# Altium schematic sheet P2.schdoc
size 594 x 421 mm; Symbol: Sheet-Symbol_A4; Company: EE_LAB; Version: V1.0; Page Size: A4; @Project Name: VIDEO_CONVERTER; @Page Count: 3; @Update Date: 2024-05-22; @Create Date: 2024-05-10; @Schematic Name: Schematic1; @Page No: 2; @Page Name: P2; Device: Sheet-Symbol_A4
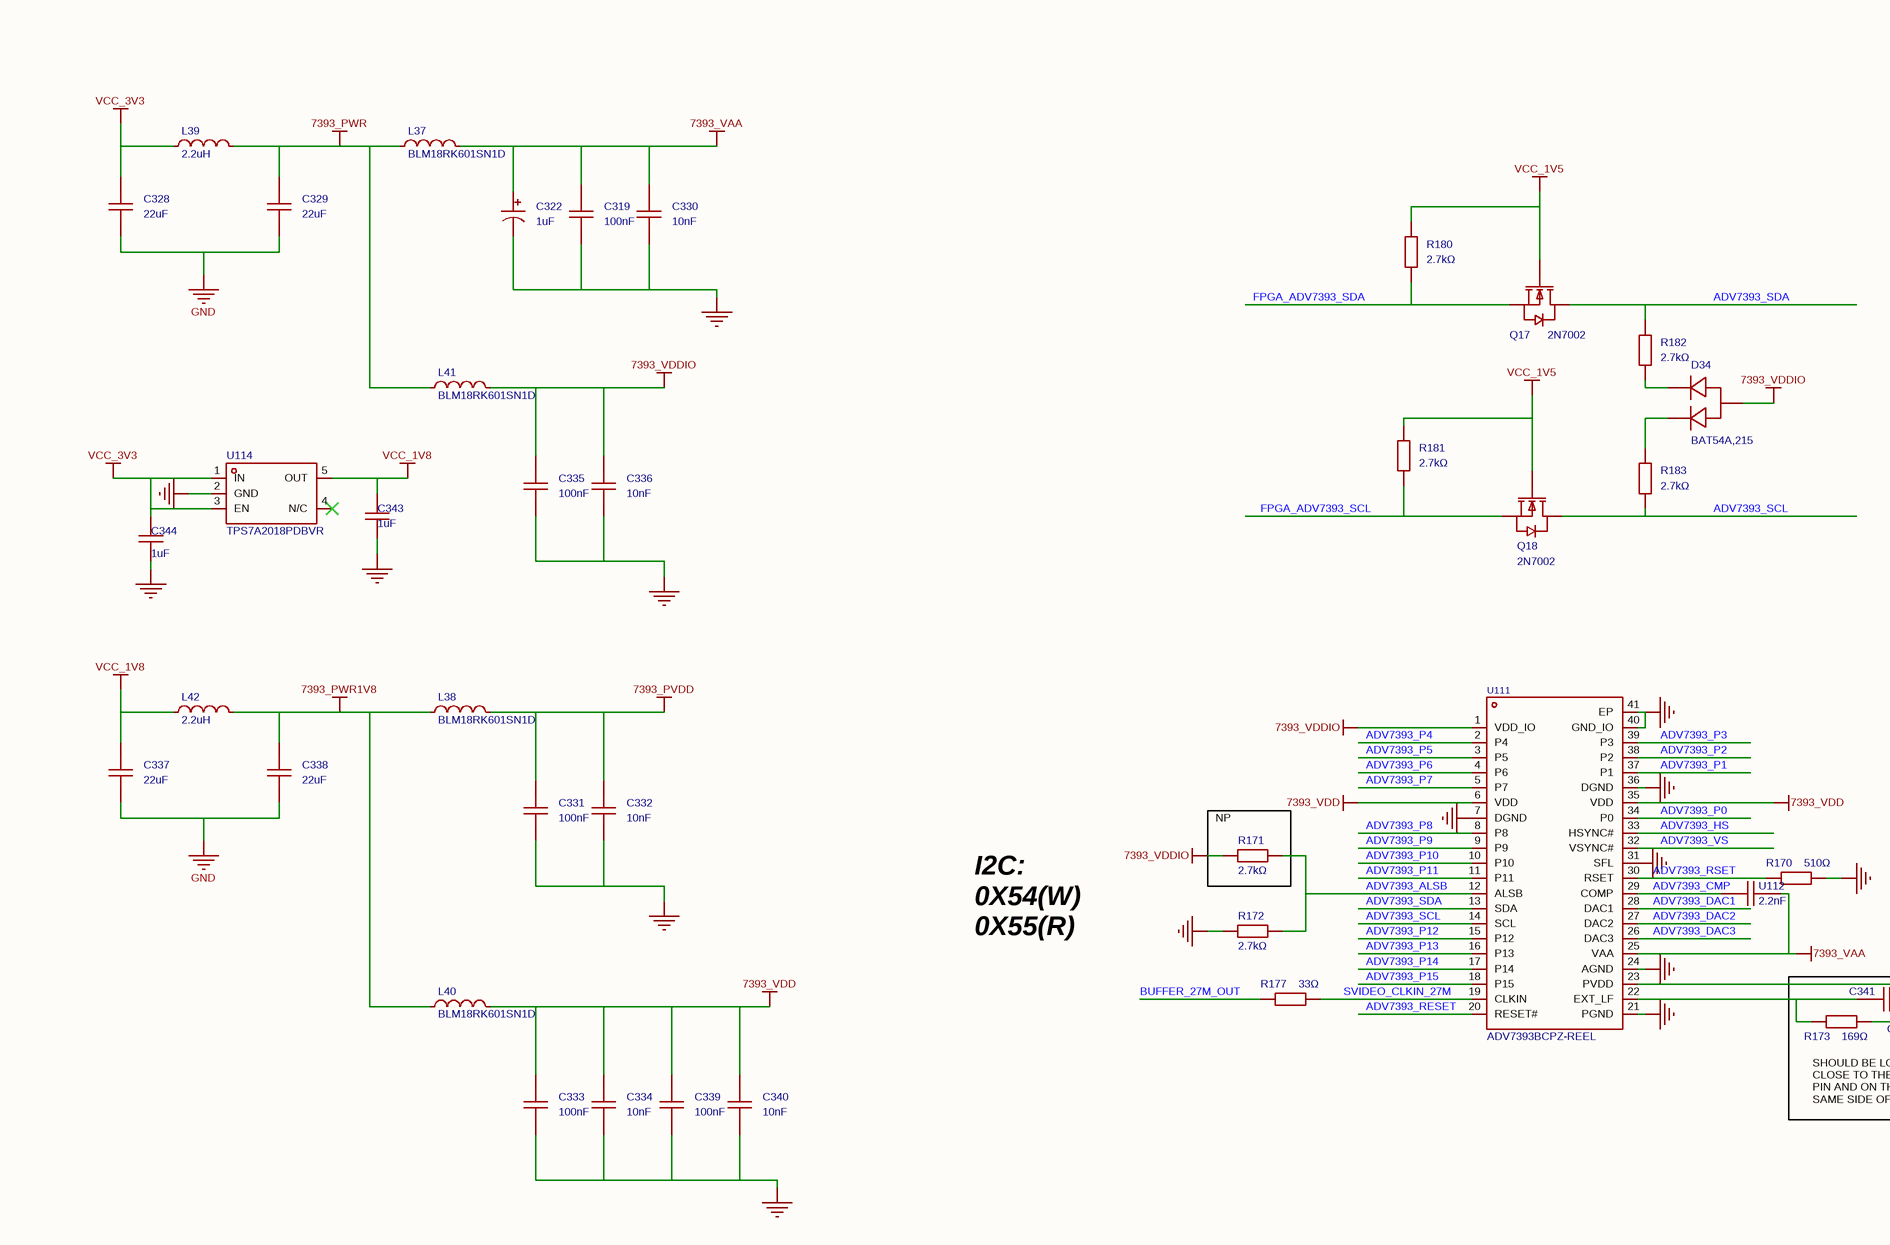
[diagram p0: P2.schdoc, top left]
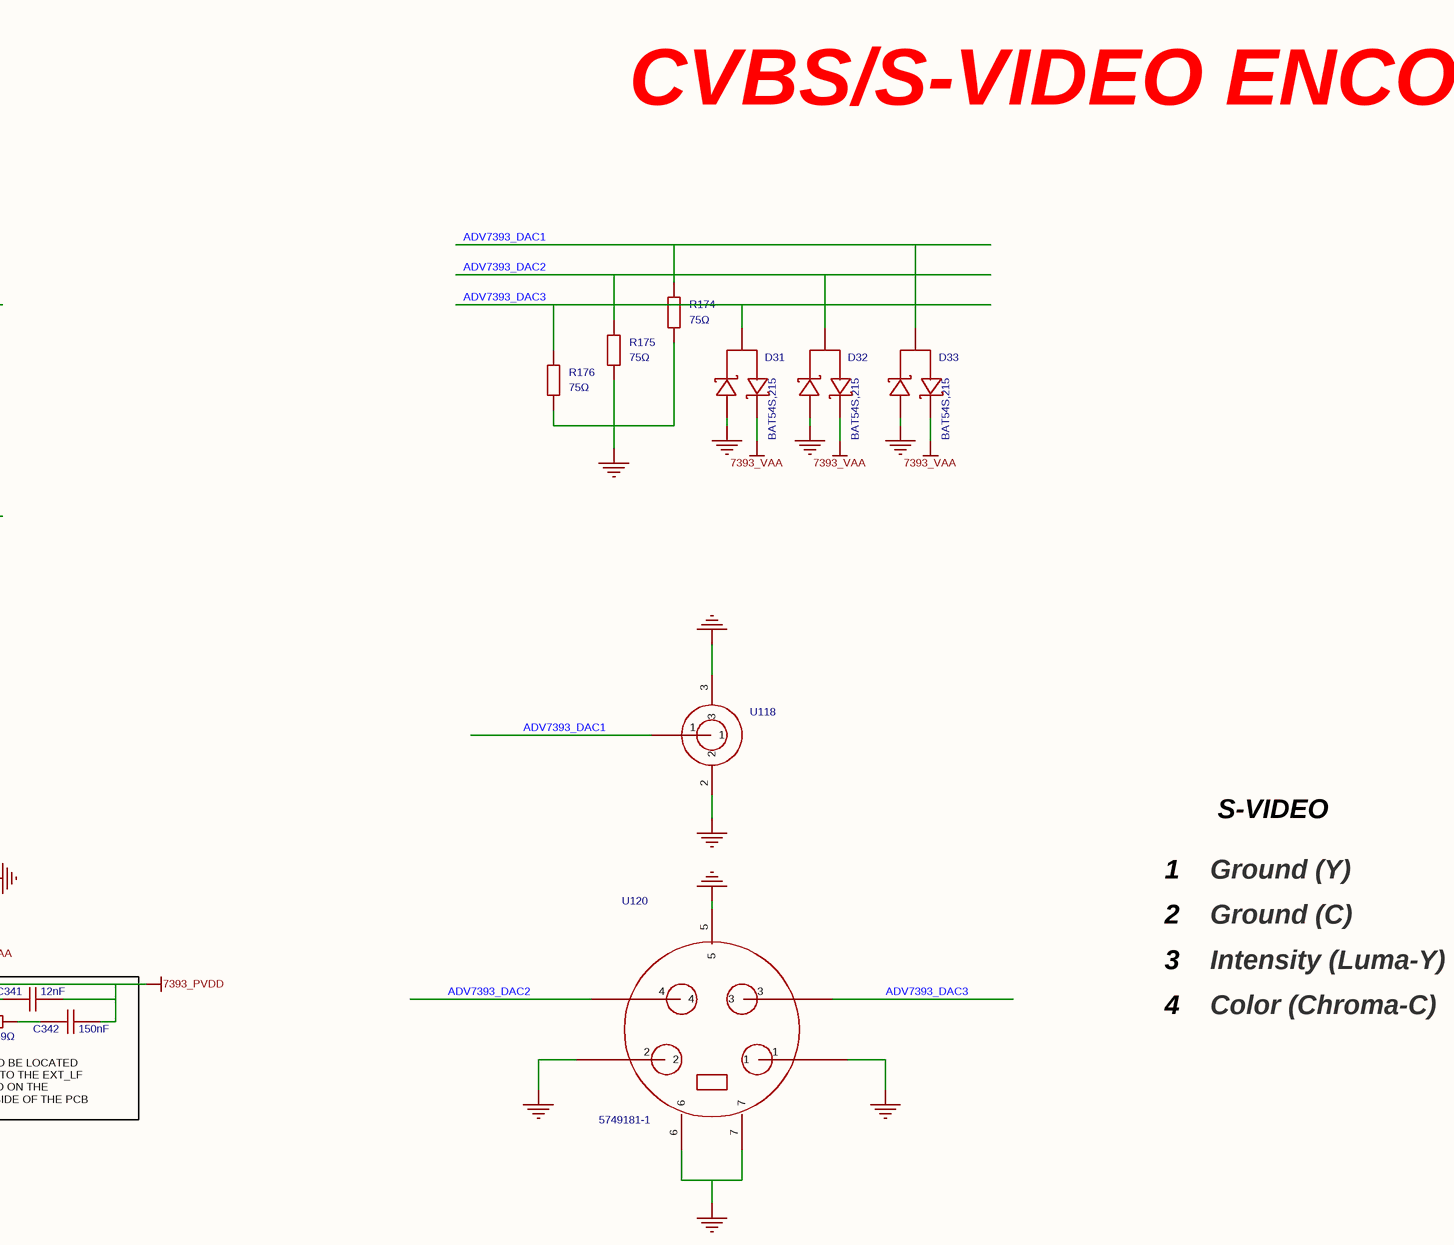
[diagram p1: P2.schdoc, top right]
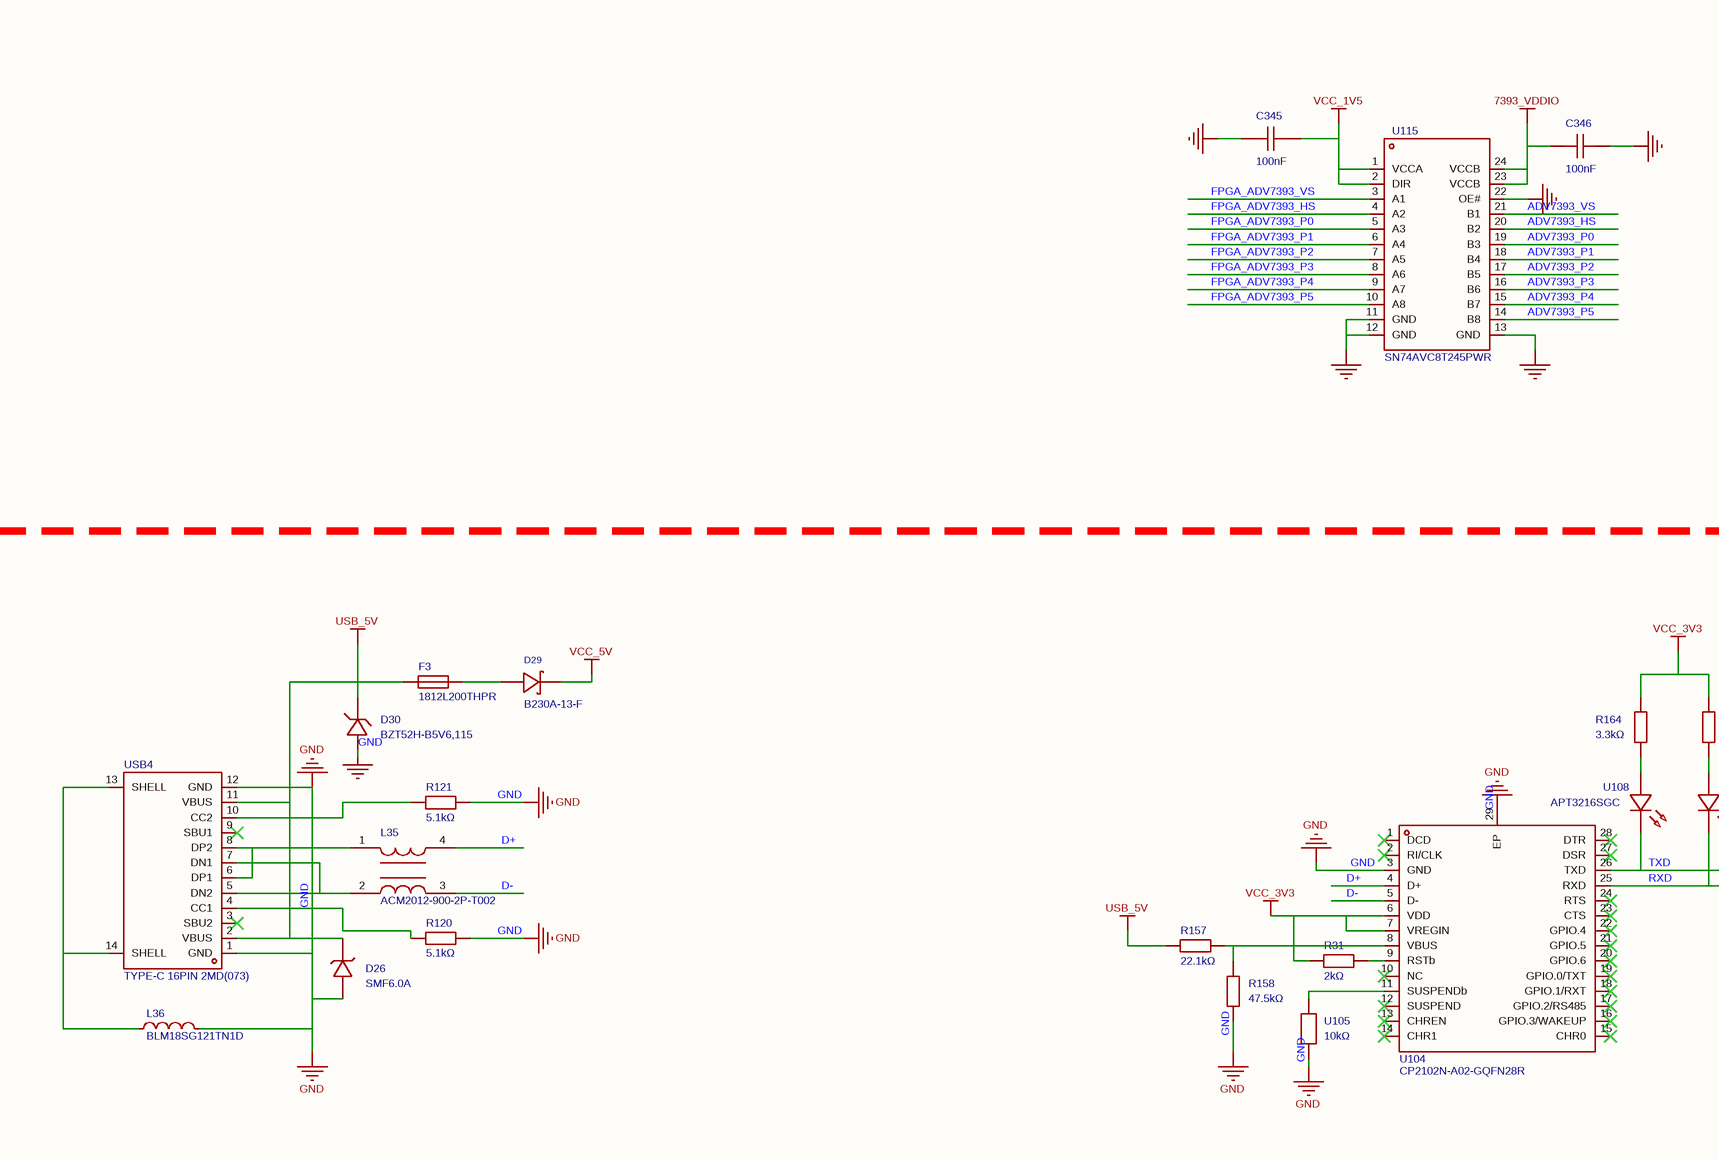
[diagram p2: P2.schdoc, bottom left]
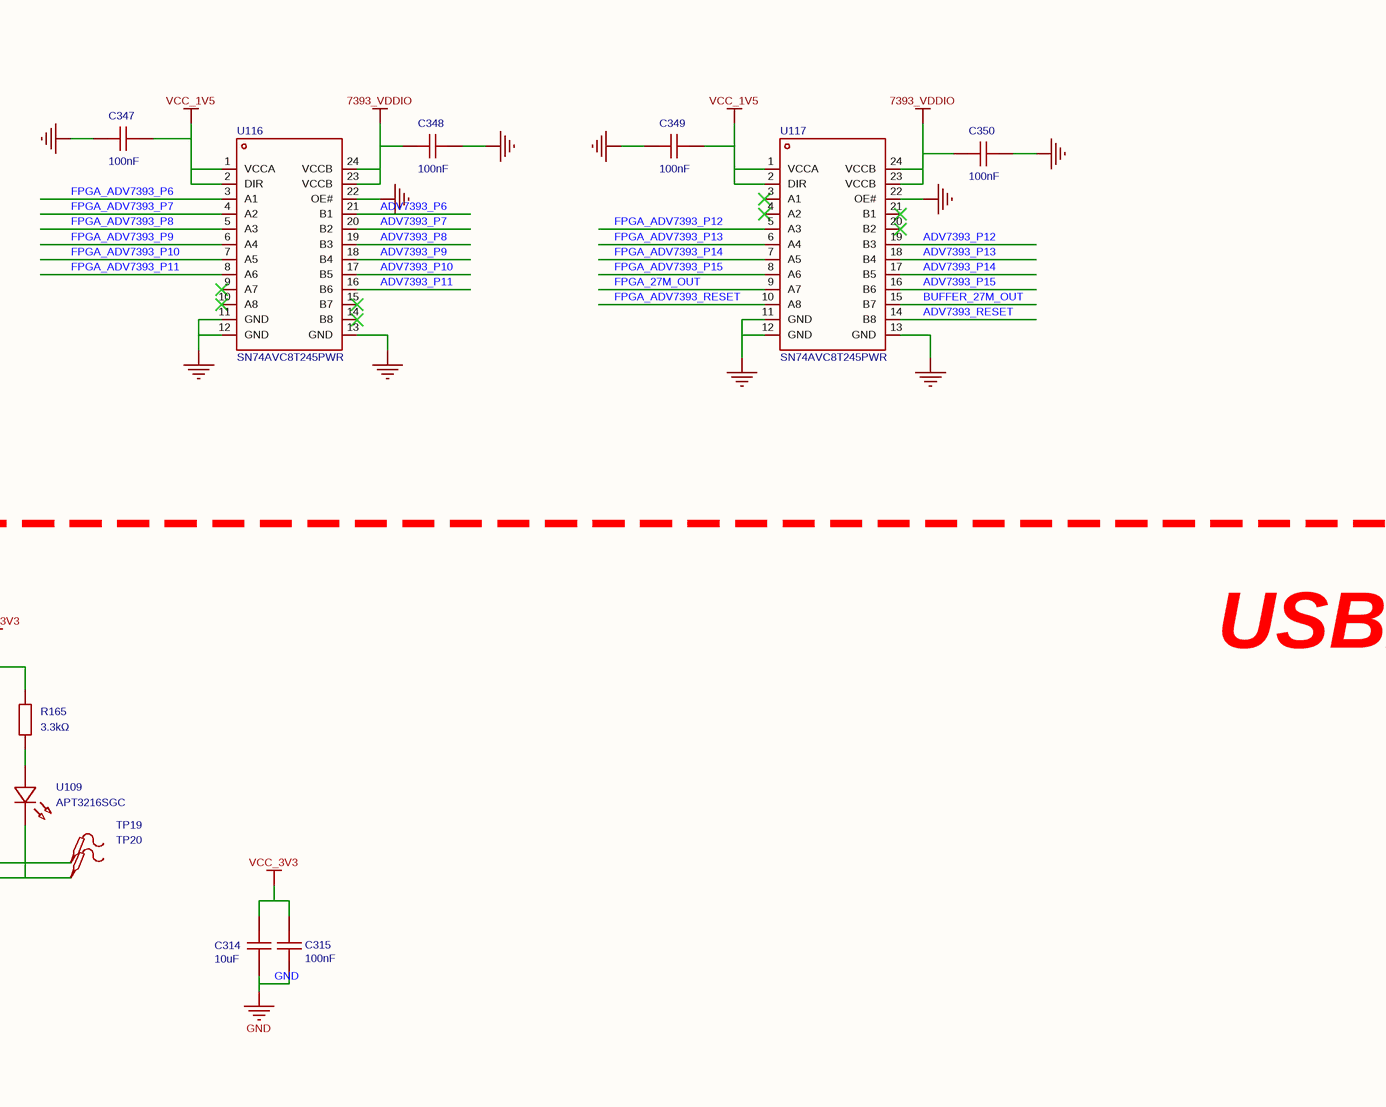
[diagram p3: P2.schdoc, bottom right]

## Parts
C314  10uF  [C0603]
C315  100nF  [C0603]
C319  100nF  [C0402]
C322  1uF  [CAP-SMD_L3.2-W1.6-FD-1]
C328  22uF  [C1210]
C329  22uF  [C1210]
C330  10nF  [C0402]
C331  100nF  [C0402]
C332  10nF  [C0402]
C333  100nF  [C0402]
C334  10nF  [C0402]
C335  100nF  [C0402]
C336  10nF  [C0402]
C337  22uF  [C1210]
C338  22uF  [C1210]
C339  100nF  [C0402]
C340  10nF  [C0402]
C341  12nF  [C0402]
C342  150nF  [C0402]
C343  1uF  [C0402]
C344  1uF  [C0402]
C345  100nF  [C0603]
C346  100nF  [C0603]
C347  100nF  [C0603]
C348  100nF  [C0603]
C349  100nF  [C0603]
C350  100nF  [C0603]
D26  SMF6.0A  [SOD-123FL_L2.8-W1.8-LS3.7-RD-1]
D29  B230A-13-F  [SMA_L4.4-W2.6-LS5.0-RD]
D30  BZT52H-B5V6,115  [SOD-123F_L2.6-W1.6-LS3.5-RD]
D31  BAT54S,215  [SOT-23-3_L3.0-W1.7-P0.95-LS2.9-BR]
D32  BAT54S,215  [SOT-23-3_L3.0-W1.7-P0.95-LS2.9-BR]
D33  BAT54S,215  [SOT-23-3_L3.0-W1.7-P0.95-LS2.9-BR]
D34  BAT54A,215  [SOT-23-3_L3.0-W1.7-P0.95-LS2.9-BR]
F3  1812L200THPR  [F1812]
L35  ACM2012-900-2P-T002  [IND-SMD_4P-L2.0-W1.2-TL]
L36  BLM18SG121TN1D  [L0603]
L37  BLM18RK601SN1D  [L0603]
L38  BLM18RK601SN1D  [L0603]
L39  2.2uH  [IND-SMD_L7.0-W6.6]
L40  BLM18RK601SN1D  [L0603]
L41  BLM18RK601SN1D  [L0603]
L42  2.2uH  [IND-SMD_L7.0-W6.6]
Q17  2N7002  [SOT-23-3_L2.9-W1.3-P1.90-LS2.4-BR]
Q18  2N7002  [SOT-23-3_L2.9-W1.3-P1.90-LS2.4-BR]
R31  2kΩ  [R0402]
R120  5.1kΩ  [R0402]
R121  5.1kΩ  [R0402]
R157  22.1kΩ  [R0402]
R158  47.5kΩ  [R0402]
R164  3.3kΩ  [R0805]
R165  3.3kΩ  [R0805]
R170  510Ω  [R0402]
R171  2.7kΩ  [R0402]
R172  2.7kΩ  [R0402]
R173  169Ω  [R0402]
R174  75Ω  [R0805]
R175  75Ω  [R0805]
R176  75Ω  [R0805]
R177  33Ω  [R0402]
R180  2.7kΩ  [R0402]
R181  2.7kΩ  [R0402]
R182  2.7kΩ  [R0402]
R183  2.7kΩ  [R0402]
TP19  (no value)  [Test-Point-0.5mm]
TP20  (no value)  [Test-Point-0.5mm]
U104  CP2102N-A02-GQFN28R  [QFN-28_L5.0-W5.0-P0.50-TL-EP3.3]
U105  10kΩ  [R0402]
U108  APT3216SGC  [LED1206-RD]
U109  APT3216SGC  [LED1206-RD]
U111  ADV7393BCPZ-REEL  [LFCSP-40_L6.0-W6.0-P0.50-BL-EP4.1]
U112  2.2nF  [C0402]
U114  TPS7A2018PDBVR  [SOT-23-5_L2.9-W1.6-P0.95-LS2.8-BR]
U115  SN74AVC8T245PWR  [TSSOP-24_L7.8-W4.4-P0.65-LS6.4-BL]
U116  SN74AVC8T245PWR  [TSSOP-24_L7.8-W4.4-P0.65-LS6.4-BL]
U117  SN74AVC8T245PWR  [TSSOP-24_L7.8-W4.4-P0.65-LS6.4-BL]
U118  (no value)  [RCA-Y]
U120  Manufacturer Part: 5749181-1  [MINI_DIN_4]
USB4  TYPE-C 16PIN 2MD(073)  [USB-C-SMD_TYPE-C-6PIN-2MD-073]

## Blocks framed on the sheet
NP: R171

## Nets
7393_PVDD: C331.1 C332.2 C341.2 C342.2 L38.2 U111.23(PVDD)
7393_PWR: C329.2 L37.1 L39.2 L41.1
7393_PWR1V8: C338.2 L38.1 L40.1 L42.2
7393_VAA: C319.1 C322.1 C330.2 D31.2(K) D32.2(K) D33.2(K) L37.2 U111.25(VAA) U112.2
7393_VDD: C333.1 C334.2 C339.1 C340.2 L40.2 U111.6(VDD) U111.35(VDD)
7393_VDDIO: C335.1 C336.2 C346.1 C348.1 C350.1 D34.3(C) L41.2 R171.2 U111.1(VDD_IO) U115.23(VCCB) U115.24(VCCB) U116.23(VCCB) U116.24(VCCB) U117.23(VCCB) U117.24(VCCB)
GND: C314.1 C315.1 C319.2 C322.2 C328.1 C329.1 C330.1 C331.2 C332.1 C333.2 C334.1 C335.2 C336.1 C337.1 C338.1 C339.2 C340.1 C343.1 C344.1 C345.2 C346.2 C347.2 C348.2 C349.2 C350.2 D26.2 D30.2(A) D31.1(A) D32.1(A) D33.1(A) L36.2 R120.1 R120.2 R121.2 R158.1 R170.2 R172.2 R174.2 R175.1 R176.1 U104.3(GND) U104.29(EP) U105.2 U111.7(DGND) U111.21(PGND) U111.24(AGND) U111.31(SFL) U111.36(DGND) U111.40(GND_IO) U111.41(EP) U114.2(GND) U115.11(GND) U115.12(GND) U115.13(GND) U115.22(OE#) U116.11(GND) U116.12(GND) U116.13(GND) U116.22(OE#) U117.11(GND) U117.12(GND) U117.13(GND) U117.22(OE#) U118.2 U118.3 U120.1 U120.2 U120.5 U120.6 U120.7 USB4.1(GND) USB4.4(CC1) USB4.12(GND)
USB_5V: D26.1 D30.1(C) F3.2 R157.2 USB4.2(VBUS) USB4.11(VBUS)
VCC_1V5: C345.1 C347.1 C349.1 Q17.1(G) Q18.1(G) R180.2 R181.2 U115.1(VCCA) U115.2(DIR) U116.1(VCCA) U116.2(DIR) U117.1(VCCA) U117.2(DIR)
VCC_1V8: C337.2 C343.2 L42.1 U114.5(OUT)
VCC_3V3: C314.2 C315.2 C328.2 C344.2 L39.1 R31.1 R164.2 R165.2 U104.6(VDD) U104.7(VREGIN) U114.1(IN) U114.3(EN)
VCC_5V: D29.1(K)
ADV7393_ALSB: R171.1 R172.1 U111.12(ALSB)
ADV7393_CMP: U111.29(COMP) U112.1
ADV7393_DAC1: D33.3(AK) R174.1 U111.28(DAC1) U118.1
ADV7393_DAC2: D32.3(AK) R175.2 U111.27(DAC2) U120.4
ADV7393_DAC3: D31.3(AK) R176.2 U111.26(DAC3) U120.3
ADV7393_HS: U111.33(HSYNC#) U115.20(B2)
ADV7393_P0: U111.34(P0) U115.19(B3)
ADV7393_P1: U111.37(P1) U115.18(B4)
ADV7393_P2: U111.38(P2) U115.17(B5)
ADV7393_P3: U111.39(P3) U115.16(B6)
ADV7393_P4: U111.2(P4) U115.15(B7)
ADV7393_P5: U111.3(P5) U115.14(B8)
ADV7393_P6: U111.4(P6) U116.21(B1)
ADV7393_P7: U111.5(P7) U116.20(B2)
ADV7393_P8: U111.8(P8) U116.19(B3)
ADV7393_P9: U111.9(P9) U116.18(B4)
ADV7393_P10: U111.10(P10) U116.17(B5)
ADV7393_P11: U111.11(P11) U116.16(B6)
ADV7393_P12: U111.15(P12) U117.19(B3)
ADV7393_P13: U111.16(P13) U117.18(B4)
ADV7393_P14: U111.17(P14) U117.17(B5)
ADV7393_P15: U111.18(P15) U117.16(B6)
ADV7393_RESET: U111.20(RESET#) U117.14(B8)
ADV7393_RSET: R170.1 U111.30(RSET)
ADV7393_SCL: Q18.3(D) R183.1 U111.14(SCL)
ADV7393_SDA: Q17.3(D) R182.2 U111.13(SDA)
ADV7393_VS: U111.32(VSYNC#) U115.21(B1)
BUFFER_27M_OUT: R177.1 U117.15(B7)
D+: L35.4 U104.4(D+)
D-: L35.3 U104.5(D-)
FPGA_27M_OUT: U117.9(A7)
FPGA_ADV7393_HS: U115.4(A2)
FPGA_ADV7393_P0: U115.5(A3)
FPGA_ADV7393_P1: U115.6(A4)
FPGA_ADV7393_P2: U115.7(A5)
FPGA_ADV7393_P3: U115.8(A6)
FPGA_ADV7393_P4: U115.9(A7)
FPGA_ADV7393_P5: U115.10(A8)
FPGA_ADV7393_P6: U116.3(A1)
FPGA_ADV7393_P7: U116.4(A2)
FPGA_ADV7393_P8: U116.5(A3)
FPGA_ADV7393_P9: U116.6(A4)
FPGA_ADV7393_P10: U116.7(A5)
FPGA_ADV7393_P11: U116.8(A6)
FPGA_ADV7393_P12: U117.5(A3)
FPGA_ADV7393_P13: U117.6(A4)
FPGA_ADV7393_P14: U117.7(A5)
FPGA_ADV7393_P15: U117.8(A6)
FPGA_ADV7393_RESET: U117.10(A8)
FPGA_ADV7393_SCL: Q18.2(S) R181.1
FPGA_ADV7393_SDA: Q17.2(S) R180.1
FPGA_ADV7393_VS: U115.3(A1)
RXD: TP20.1 U104.25(RXD) U109.1(K)
SVIDEO_CLKIN_27M: R177.2 U111.19(CLKIN)
TXD: TP19.1 U104.26(TXD) U108.1(K)
NetC341_1: C341.1 R173.1 U111.22(EXT_LF)
NetC342_1: C342.1 R173.2
NetD29_2: D29.2(A) F3.1
NetD34_1: D34.1(A) R182.1
NetD34_2: D34.2(A) R183.2
NetL35_1: L35.1 USB4.6(DP1) USB4.8(DP2)
NetL35_2: L35.2 USB4.5(DN2) USB4.7(DN1)
NetL36_1: L36.1 USB4.13(SHELL) USB4.14(SHELL)
NetR31_2: R31.2 U104.9(RSTb)
NetR121_1: R121.1 USB4.10(CC2)
NetR157_1: R157.1 R158.2 U104.8(VBUS)
NetR164_1: R164.1 U108.2(A)
NetR165_1: R165.1 U109.2(A)
NetU104_11: U104.11(SUSPENDb) U105.1

Not connected (* = marked no-connect by the designer): U104 1(DCD)* 2(RI/CLK)* 10(NC)* 12(SUSPEND)* 13(CHREN)* 14(CHR1)* 15(CHR0)* 16(GPIO.3/WAKEUP)* 17(GPIO.2/RS485)* 18(GPIO.1/RXT)* 19(GPIO.0/TXT)* 20(GPIO.6)* 21(GPIO.5)* 22(GPIO.4)* 23(CTS)* 24(RTS)* 27(DSR)* 28(DTR)*; U114 4(N/C)*; U116 9(A7)* 10(A8)* 14(B8)* 15(B7)*; U117 3(A1)* 4(A2)* 20(B2)* 21(B1)*; USB4 3(SBU2)* 9(SBU1)*

## Notes on the sheet
- CVBS/S-VIDEO ENCODER
- I2C:
  0X54(W)
  0X55(R)
- S-VIDEO
- 1
- 2
- Ground (Y)
- Ground (C)
- 3
- Intensity (Luma-Y)
- SHOULD BE LOCATED
  CLOSE TO THE EXT_LF
  PIN AND ON THE
  SAME SIDE OF THE PCB
- 4
- Color (Chroma-C)
- USB2UART
- 更新日期
- 2024-05-22
- 原理图
- 图页
- Schematic1
- P2
- 创建日期
- 物料编码
- 2024-05-10
- 审阅
- 绘制
- VIDEO_CONVERTER
- 版本
- V1.0
- 尺寸
- A4
- 页
- EE_LAB
- 共

## Library data of the parts
C314 = 10uF: Manufacturer: TDK; Manufacturer Part: C1608X5R1A106M080AC; Convert to PCB: yes; Device: 10uF; Symbol: 10uF; Supplier: LCSC; Supplier Part: C3877917; link: https://so.szlcsc.com/global.html?k=C3877917&amp;ref=editor; Add into BOM: yes; FootprintName: C0603
C315 C345-C350 = GRM188R71H104KA93D: 容值:100nF;精度:±10%;额定电压:50V;材质(温度系数):X7R;; Manufacturer: muRata(村田); Symbol: 0.1uF; Convert to PCB: yes; ModelId: ac125912035d415993ca9572d50418b1; ModelName: C0603_L1.6-W0.8-H0.8; ModelTransform: 62.992,31.496,0,0,0,0,0,0,0; Tolerance: ±10%; Voltage Rated: 50V; Temperature Coefficient: X7R; Device: GRM188R71H104KA93D; Supplier: LCSC; Supplier Part: C77055; Manufacturer Part: GRM188R71H104KA93D; JLCPCB Part Class: Extended Part; link: https://so.szlcsc.com/global.html?k=C2168571&amp;ref=editor; Add into BOM: yes; LCSC Part Name: 100nF ±10% 50V; Supplier Footprint: 0603; Datasheet: https://atta.szlcsc.com/upload/public/pdf/source/20200305/C490387_23319AE8C154DEB24C505E6C82A8106A.pdf; FootprintName: C0603; Value: 100nF
C319 C331 C333 C335 C339 = GCM155R71A104KA55D: 容值:100nF;精度:±10%;额定电压:10V;材质(温度系数):X7R;; Manufacturer: muRata(村田); AddInBom: yes; ModelId: 36a51122f27c49738f86b3bfa98863e0; ModelName: C0402_L1.0-W0.5-H0.5; ModelTransform: 39.37,19.685,0,0,0,0,0,0,0; Tolerance: ±10%; Voltage Rated: 10V; Temperature Coefficient: X7R; Symbol: GCM155R71A104KA55D; Device: GCM155R71A104KA55D; LCSC Part Name: 100nF ±10% 10V; SupplierPart: C161163; ManufacturerPart: GCM155R71A104KA55D; Supplier Footprint: 0402; JLCPCB Part Class: 扩展库; Datasheet: https://atta.szlcsc.com/upload/public/pdf/source/20180821/C161163_5F90D1CDF6FD55851A9BB75B6044C401.pdf; Supplier: LCSC; ConvertToPcb: yes; FootprintName: C0402; Value: 100nF
C322 = 293D105X9035A2TE3: 容值:1uF;精度:±10%;额定电压:35V;等效串联电阻:7.5Ω;; Manufacturer: VISHAY(威世); Symbol: 20TQC22MYFB; AddInBom: yes; ModelId: 93c1e47824ed479aadd5af965695f2d8; ModelTransform: 125.984,62.992,0,0,0,0,0,0,0; Tolerance: ±10%; Rated Voltage: 35V; Equivalent Series Resistance(ESR): 7.5Ω; Device: 293D105X9035A2TE3; Supplier: LCSC; Supplier Part: C1953185; Manufacturer Part: 293D105X9035A2TE3; Value: 1uF; JLCPCB Part Class: Extended Part; LCSC Part Name: 1uF ±10% 35V; Supplier Footprint: 1206; Datasheet: https://atta.szlcsc.com/upload/public/pdf/source/20210430/5F5654738936DAF6EE15800967345E6B.pdf; ConvertToPcb: yes; FootprintName: CAP-SMD_L3.2-W1.6-FD-1; ModelName: CAP-SMD_L3.2-W1.6-FD-1; Leakage Current(DCL): -; Ripple Current: -; Operating Temperature: -55℃~+125℃
C328 C329 C337 C338 = GRM32ER71E226KE15L: 容值:22uF;精度:±10%;额定电压:25V;材质(温度系数):X7R;; Manufacturer: muRata(村田); AddInBom: yes; ModelId: 113f675d30df4856af7632edb7ada0df; ModelName: C1210_L3.2-W2.5-H0.9; ModelTransform: 125.984,99.2124,0,0,0,0,0,0,0; Tolerance: ±10%; Voltage Rated: 25V; Temperature Coefficient: X7R; Symbol: GRM32ER71E226KE15L; Device: GRM32ER71E226KE15L; Supplier: LCSC; Supplier Part: C21397; Manufacturer Part: GRM32ER71E226KE15L; Value: 22uF; JLCPCB Part Class: 扩展库; LCSC Part Name: 22uF ±10% 25V; Supplier Footprint: 1210; Datasheet: https://atta.szlcsc.com/upload/public/pdf/source/20230811/6AA9DB9766E5496748A2F980D0C94A94.pdf; ConvertToPcb: yes; FootprintName: C1210
C330 C332 C334 C336 C340 = GRM155R71H103KA88D: 容值:10nF;精度:±10%;额定电压:50V;材质(温度系数):X7R;; Manufacturer: muRata(村田); Symbol: GCM155R71H103KA55D; AddInBom: yes; ModelId: 36a51122f27c49738f86b3bfa98863e0; ModelName: C0402_L1.0-W0.5-H0.5; ModelTransform: 39.37,19.685,0,0,0,0,0,0,0; Tolerance: ±10%; Voltage Rated: 50V; Temperature Coefficient: X7R; Device: GRM155R71H103KA88D; Supplier: LCSC; Manufacturer Part: GRM155R71H103KA88D; Value: 10nF; Supplier Part: C77019; JLCPCB Part Class: Extended Part; LCSC Part Name: 10nF ±10% 50V; Supplier Footprint: 0402; Datasheet: https://atta.szlcsc.com/upload/public/pdf/source/20180326/C77019_6A3693CE1BCE757D6A8B7C99DAE1B441.pdf; ConvertToPcb: yes; FootprintName: C0402
C341 = CC0402KRX7R8BB123: 容值:12nF;精度:±10%;额定电压:25V;材质(温度系数):X7R;; Manufacturer: YAGEO(国巨); AddInBom: yes; ModelId: 36a51122f27c49738f86b3bfa98863e0; ModelName: C0402_L1.0-W0.5-H0.5; ModelTransform: 39.37,19.685,0,0,0,0,0,0,0; Tolerance: ±10%; Voltage Rated: 25V; Temperature Coefficient: X7R; Symbol: CC0402KRX7R8BB123; Device: CC0402KRX7R8BB123; Supplier: LCSC; Supplier Part: C113786; Manufacturer Part: CC0402KRX7R8BB123; Value: 12nF; JLCPCB Part Class: 扩展库; LCSC Part Name: 12nF ±10% 25V; Supplier Footprint: 0402; Datasheet: https://atta.szlcsc.com/upload/public/pdf/source/20170914/C128857_1505359892143968080.pdf; ConvertToPcb: yes; FootprintName: C0402
C342 = GRM155R71C154KA12D: 容值:150nF;精度:±10%;额定电压:16V;材质(温度系数):X7R;; Manufacturer: muRata(村田); AddInBom: yes; ModelId: 36a51122f27c49738f86b3bfa98863e0; ModelName: C0402_L1.0-W0.5-H0.5; ModelTransform: 39.37,19.685,0,0,0,0,0,0,0; Tolerance: ±10%; Voltage Rated: 16V; Temperature Coefficient: X7R; Symbol: GRM155R71C154KA12D; Device: GRM155R71C154KA12D; Supplier: LCSC; Supplier Part: C162182; Manufacturer Part: GRM155R71C154KA12D; Value: 150nF; JLCPCB Part Class: 扩展库; LCSC Part Name: 150nF ±10% 16V; Supplier Footprint: 0402; Datasheet: https://atta.szlcsc.com/upload/public/pdf/source/20200305/C490387_23319AE8C154DEB24C505E6C82A8106A.pdf; ConvertToPcb: yes; FootprintName: C0402
C343 C344 = GRM155R61E105KA12D: 容值:1uF;精度:±10%;额定电压:25V;材质(温度系数):X5R;; Manufacturer: muRata(村田); AddInBom: yes; ModelId: 36a51122f27c49738f86b3bfa98863e0; ModelName: C0402_L1.0-W0.5-H0.5; ModelTransform: 39.37,19.685,0,0,0,0,0,0,0; Tolerance: ±10%; Voltage Rated: 25V; Temperature Coefficient: X5R; Symbol: GRM155R61E105KA12D; Device: GRM155R61E105KA12D; Supplier: LCSC; Manufacturer Part: GRM155R61E105KA12D; Value: 1uF; Supplier Part: C77009; JLCPCB Part Class: 扩展库; LCSC Part Name: 1uF ±10% 25V; Supplier Footprint: 0402; Datasheet: https://atta.szlcsc.com/upload/public/pdf/source/20180326/C77009_C84F63FC30571BAC77C5C818267378FE.pdf; ConvertToPcb: yes; FootprintName: C0402
D26 = SMF6.0A_C708002: 极性:单向;反向截止电压(Vrwm):6V;最大钳位电压:10.3V;峰值脉冲电流(Ipp)@10/1000us:19.4A;击穿电压:6.7V;; Manufacturer: FTR(乔光电子); AddInBom: yes; ModelId: 321bc188a2eb4b418ce08d06d1c3a1f1; ModelTransform: 145.669,70.866,0,0,0,0,0,0,0; polarity: 单向; Reverse Stand-Off Voltage (Vrwm): 6V; Maximum Clamping Voltage: 10.3V; Peak Pulse Current (Ipp)@10/1000us: 19.4A; Breakdown Voltage: 6.7V; Symbol: SMF6.0A_C708002; Device: SMF6.0A_C708002; Supplier: LCSC; Supplier Part: C708002; Manufacturer Part: SMF6.0A; JLCPCB Part Class: 扩展库; LCSC Part Name: SMF6.0A; Supplier Footprint: SMF(SOD-123FL); Datasheet: https://atta.szlcsc.com/upload/public/pdf/source/20200720/C707467_F9F5DD7822E01E4AA7143D88A897A414.pdf; ConvertToPcb: yes; FootprintName: SOD-123FL_L2.8-W1.8-LS3.7-RD-1; ModelName: SOD-123FL_L2.8-W1.8-LS3.7-RD-1
D29 = B230A-13-F: 正向压降(Vf):500mV@2A;直流反向耐压(Vr):30V;平均整流电流(Io):2A;; Manufacturer: DIODES(美台); AddInBom: yes; ModelId: a2d22152f8d5421c8e96dbd56af7c345; ModelTransform: 204.724,98.425,0,0,0,0,0,0,0; Reverse Voltage (Vr): 30V; Average Rectified Current (Io): 2A; Reverse Leakage Current (Ir): 500uA@30V; Symbol: B230A-13-F; Device: B230A-13-F; Supplier: LCSC; Manufacturer Part: B230A-13-F; Supplier Part: C12889; JLCPCB Part Class: 扩展库; LCSC Part Name: 电压:30V 电流:2A; Supplier Footprint: SMA(DO-214AC); Datasheet: https://atta.szlcsc.com/upload/public/pdf/source/20191129/C460673_65E0A67BF9F553882F22D2B39F8BCAEF.pdf; ConvertToPcb: yes; FootprintName: SMA_L4.4-W2.6-LS5.0-RD; ModelName: SMA_L4.4-W2.6-LS5.0-RD; Forward Voltage (Vf@If): 500mV@2A
D30 = BZT52H-B5V6,115: 二极管配置:独立式;稳压值(标称值):5.6V;稳压值(范围):5.49V~5.71V;功率:375mW;精度:±2%;; Manufacturer: Nexperia(安世); AddInBom: yes; ModelId: a099669e960c4e6d91214e62d8e45b94; ModelTransform: 137.795,62.992,0,0,0,0,0,0,0; Diode Configuration: 独立式; Zener Voltage (Nom): 5.6V; Reverse Leakage Current (Ir): 1uA@2V; Power Dissipation: 375mW; Zener Impedance (Zzt): 40Ω; Tolerance: ±2%; Symbol: BZT52H-B5V6,115; Device: BZT52H-B5V6,115; LCSC Part Name: BZT52H-B5V6,115; SupplierPart: C426804; ManufacturerPart: BZT52H-B5V6,115; Supplier Footprint: SOD-123F; JLCPCB Part Class: 扩展库; Datasheet: https://atta.szlcsc.com/upload/public/pdf/source/20200310/C493582_3AB991C7AA86494D92E4C7FA68C6C679.pdf; Supplier: LCSC; ConvertToPcb: yes; FootprintName: SOD-123F_L2.6-W1.6-LS3.5-RD; ModelName: SOD-123F_L2.6-W1.6-LS3.5-RD; Zener Voltage (Range): 5.49V~5.71V
D31-D33 = BAT54S,215: 二极管配置:1对串联式;正向压降(Vf):800mV@100mA;直流反向耐压(Vr):30V;平均整流电流(Io):200mA;; Manufacturer: Nexperia(安世); AddInBom: yes; ModelId: 89cb27a44ab2466697082bb9fd73a7d0; ModelName: SOT-23-3L_L2.9-W1.6-H1.1-LS2.8-P0.95; ModelTransform: 114.173,110.236,0,90,0,0,0,0,0; Diode Configuration: 1对串联式; Reverse Voltage (Vr): 30V; Average Rectified Current (Io): 200mA; Reverse Leakage Current (Ir): 2uA@25V; Symbol: BAT54S,215; Device: BAT54S,215; Supplier: LCSC; Manufacturer Part: BAT54S,215; Supplier Part: C47546; JLCPCB Part Class: 扩展库; LCSC Part Name: 电压:30V 电流:200mA; Supplier Footprint: SOT-23; Datasheet: https://atta.szlcsc.com/upload/public/pdf/source/20180326/C130910_AAC331EF45C4B7D7866DD336DA3C5D86.pdf; ConvertToPcb: yes; FootprintName: SOT-23-3_L3.0-W1.7-P0.95-LS2.9-BR; Forward Voltage (Vf@If): 800mV@100mA
D34 = BAT54A,215: 二极管配置:1对共阳极;直流反向耐压(Vr):30V;平均整流电流(Io):200mA;; Manufacturer: Nexperia(安世); AddInBom: yes; ModelId: 89cb27a44ab2466697082bb9fd73a7d0; ModelName: SOT-23-3L_L2.9-W1.6-H1.1-LS2.8-P0.95; ModelTransform: 114.173,110.236,0,90,0,0,0,0,0; Diode Configuration: 1对共阳极; Reverse Voltage (Vr): 30V; Average Rectified Current (Io): 200mA; Reverse Leakage Current (Ir): 2uA@25V; Symbol: BAT54A,215; Device: BAT54A,215; LCSC Part Name: 电压:30V 电流:200mA; SupplierPart: C130910; ManufacturerPart: BAT54A,215; Supplier Footprint: SOT-23; JLCPCB Part Class: 扩展库; Datasheet: https://atta.szlcsc.com/upload/public/pdf/source/20180326/C130910_AAC331EF45C4B7D7866DD336DA3C5D86.pdf; Supplier: LCSC; ConvertToPcb: yes; FootprintName: SOT-23-3_L3.0-W1.7-P0.95-LS2.9-BR
F3 = 1812L200THPR: 最大电压:8V;最大电流:100A;保持电流:2A;跳闸电流:3.5A;; Manufacturer: Littelfuse(美国力特); AddInBom: yes; ModelId: bca21e458c564d38b781621ca22e660b; ModelName: F1812_L4.5-W3.2-H1.0; ModelTransform: 177.165,125.984,0,0,0,0,0.0005,0,0; Operating Voltage (Max): 8V; Current Rating (Max): 100A; Hold Current: 2A; Trip Current: 3.5A; Resistance - Initial (Ri) (Min): 20mΩ; Resistance - Post Trip (R1) (Max): 70mΩ; Maximum Time to Trip: 2s; Symbol: 1812L200THPR; Device: 1812L200THPR; Supplier: LCSC; Supplier Part: C207074; Manufacturer Part: 1812L200THPR; JLCPCB Part Class: 扩展库; LCSC Part Name: 8V 2A 1812自恢复; Supplier Footprint: 1812; Datasheet: https://atta.szlcsc.com/upload/public/pdf/source/20181031/C315901_C3D1AA68B7E2FCFB6B7163300867CF3D.pdf; ConvertToPcb: yes; FootprintName: F1812; Power Dissipation: -; Operating Temperature: -40℃~+85℃
L35 = ACM2012-900-2P-T002: 线路数:2;阻抗 @ 频率:90Ω@100MHz;额定电流:400mA;直流电阻(DCR):190mΩ;直流额定电压(VDC):50V;工作温度:-25℃~+85℃;耐电压:50V;; Manufacturer: TDK; AddInBom: yes; ModelId: c0f1343e4f604aadb71434d9026add63; ModelName: IND-SMD_4P-L2.0-W1.2-H1.3; ModelTransform: 79.527,47.244,0,0,0,0,0.01,-0.016,0; Number of Lines: 2; Current Rating: 400mA; DC Resistance (DCR): 190mΩ; Voltage Rating - DC: 50V; Symbol: ACM2012-900-2P-T002; Device: ACM2012-900-2P-T002; LCSC Part Name: 90Ω@100MHz 400mA; SupplierPart: C19972; ManufacturerPart: ACM2012-900-2P-T002; Supplier Footprint: SMD-4P; JLCPCB Part Class: 扩展库; Datasheet: https://atta.szlcsc.com/upload/public/pdf/source/20200629/C19972_344527C0CEDC971B6C9D0CA9AC65ADB7.pdf; Supplier: LCSC; ConvertToPcb: yes; FootprintName: IND-SMD_4P-L2.0-W1.2-TL; Impedance @ Frequency: 90Ω@100MHz; Operating Temperature: -25℃~+85℃; Withstanding Voltage: 50V
L36 = BLM18SG121TN1D: 标称阻抗@测试频率:120Ω@100MHz;误差:±25%;直流电阻(RDC):25mΩ;; Manufacturer: muRata(村田); AddInBom: yes; ModelId: 2bc5ec593d464d6ba9807aec0b5673c2; ModelName: L0603_L1.6-W0.8-H0.5_BEAD; ModelTransform: 62.992,31.496,0,180,0,0,0.094,0.629,0; Tolerance: ±25%; DC Resistance: 25mΩ; Current Rating: 3A; Circuits: 1; JLCPCB Part Class: Extended Part; Datasheet: https://atta.szlcsc.com/upload/public/pdf/source/20170523/1495533956327.pdf; Symbol: BLM18SG121TN1D; Device: BLM18SG121TN1D; LCSC Part Name: 单路 0603磁珠 阻抗120Ω@100MHz; SupplierPart: C113030; ManufacturerPart: BLM18SG121TN1D; Supplier Footprint: 0603; Supplier: LCSC; ConvertToPcb: yes; FootprintName: L0603; Impedance @ Frequency: 120Ω@100MHz
L37 L38 L40 L41 = BLM18RK601SN1D: 标称阻抗@测试频率:600Ω@100MHz;误差:±25%;直流电阻(RDC):600mΩ;; Manufacturer: muRata(村田); AddInBom: yes; ModelId: 2bc5ec593d464d6ba9807aec0b5673c2; ModelName: L0603_L1.6-W0.8-H0.5_BEAD; ModelTransform: 62.992,31.496,0,180,0,0,0.094,0.629,0; Tolerance: ±25%; DC Resistance: 600mΩ; Current Rating: 200mA; Circuits: 1; Symbol: BLM18RK601SN1D; Device: BLM18RK601SN1D; LCSC Part Name: 单路 0603磁珠 阻抗600Ω@100MHz; SupplierPart: C88987; ManufacturerPart: BLM18RK601SN1D; Supplier Footprint: 0603; JLCPCB Part Class: 扩展库; Datasheet: https://atta.szlcsc.com/upload/public/pdf/source/20180329/C160981_FD3C2D2622A377E203B89F4AA32B0741.pdf; Supplier: LCSC; ConvertToPcb: yes; FootprintName: L0603; Impedance @ Frequency: 600Ω@100MHz
L39 L42 = FXL0630-2R2-M: 电感值:2.2uH;精度:±20%;额定电流:9.5A;饱和电流(Isat):10A;类型:一体成型电感;; Manufacturer: cjiang(长江微电); AddInBom: yes; ModelId: 6860c29aec394a38a0f014af7f722a42; ModelName: IND-SMD_L7.0-W6.6-H3.0; ModelTransform: 275.59,259.842,0,0,0,0,0,0,0; Tolerance: ±20%; Rated Current: 9.5A; Saturation Current (Isat): 10A; DC Resistance (DCR): 15mΩ; Type: 一体成型电感; Symbol: FXL0630-2R2-M; Device: FXL0630-2R2-M; LCSC Part Name: 2.2uH ±20% 10A; SupplierPart: C167218; ManufacturerPart: FXL0630-2R2-M; Supplier Footprint: SMD,6.6x7mm; JLCPCB Part Class: 扩展库; Datasheet: https://atta.szlcsc.com/upload/public/pdf/source/20230516/3A080F5AF8C87BB81C3BA86E5F60E51A.pdf; Supplier: LCSC; ConvertToPcb: yes; FootprintName: IND-SMD_L7.0-W6.6; Value: 2.2uH
Q17 Q18 = 2N7002_C8545: 类型:N沟道;漏源电压(Vdss):60V;连续漏极电流(Id):115mA;功率(Pd):200mW;导通电阻(RDS(on)@Vgs,Id):7.5Ω@10V,500mA;阈值电压(Vgs(th)@Id):2.5V@250uA;; Manufacturer: CJ(江苏长电/长晶); AddInBom: yes; ModelId: c62791f0466c4ae2a892c056b845b0ca; ModelName: SOT-23-3P_L2.9-W1.3-H1.0-LS2.4-P0.95; ModelTransform: 98.425,114.173,0,180,0,0,0.0005,-0.0005,0; Type: N沟道; Drain Source Voltage (Vdss): 60V; Continuous Drain Current (Id): 115mA; Power Dissipation (Pd): 200mW; Symbol: 2N7002; Device: 2N7002_C8545; LCSC Part Name: N沟道 耐压:60V 电流:115mA; SupplierPart: C8545; ManufacturerPart: 2N7002; Supplier Footprint: SOT-23; JLCPCB Part Class: 基础库; Datasheet: https://atta.szlcsc.com/upload/public/pdf/source/20171228/C164913_15144413269051213916.pdf; Supplier: LCSC; ConvertToPcb: yes; FootprintName: SOT-23-3_L2.9-W1.3-P1.90-LS2.4-BR; Drain Source On Resistance (RDS(on)@Vgs,Id): 7.5Ω@10V,500mA; Gate Threshold Voltage (Vgs(th)@Id): 2.5V@250uA
R31 = RC0402FR-072KL: 电阻类型:厚膜电阻;阻值:2kΩ;精度:±1%;功率:62.5mW;最大工作电压:50V;温度系数:±100ppm/℃;; Manufacturer: YAGEO(国巨); Symbol: AR03DTDX2001; AddInBom: yes; ModelId: 671aefced39d4c318694bba8bd8efd39; ModelName: R0402_L1.0-W0.5-H0.5; ModelTransform: 39.37,19.685,0,0,0,0,0,0.0005,0; Tolerance: ±1%; Power(Watts): 62.5mW; Overload Voltage (Max): 50V; Device: RC0402FR-072KL; LCSC Part Name: 厚膜电阻 2kΩ ±1% 62.5mW; SupplierPart: C60488; ManufacturerPart: RC0402FR-072KL; Supplier Footprint: 0402; JLCPCB Part Class: Extended Part; Datasheet: https://atta.szlcsc.com/upload/public/pdf/source/20180821/C275644_0D56F95EFF785E7D9A1FEF436B37DA78.pdf; Supplier: LCSC; ConvertToPcb: yes; FootprintName: R0402; Type: 厚膜电阻; Value: 2kΩ; Temperature Coefficient: ±100ppm/℃; Operating Temperature Range: -55℃~+155℃
R120 R121 = RC0402FR-075K1L: 电阻类型:厚膜电阻;阻值:5.1kΩ;精度:±1%;功率:62.5mW;最大工作电压:50V;温度系数:±100ppm/℃;; Manufacturer: YAGEO(国巨); Symbol: 0603WAF5101T5E; AddInBom: yes; ModelId: 671aefced39d4c318694bba8bd8efd39; ModelName: R0402_L1.0-W0.5-H0.5; ModelTransform: 39.37,19.685,0,0,0,0,0,0.0005,0; Tolerance: ±1%; Power(Watts): 62.5mW; Overload Voltage (Max): 50V; Device: RC0402FR-075K1L; Supplier: LCSC; Manufacturer Part: RC0402FR-075K1L; Supplier Part: C105872; Value: 5.1kΩ; JLCPCB Part Class: Extended Part; LCSC Part Name: 厚膜电阻 5.1kΩ ±1% 62.5mW; Supplier Footprint: 0402; Datasheet: https://atta.szlcsc.com/upload/public/pdf/source/20180821/C275644_0D56F95EFF785E7D9A1FEF436B37DA78.pdf; ConvertToPcb: yes; FootprintName: R0402; Type: 厚膜电阻; Temperature Coefficient: ±100ppm/℃; Operating Temperature Range: -55℃~+155℃
R157 = RC0402FR-0722K1L: 电阻类型:厚膜电阻;阻值:22.1kΩ;精度:±1%;功率:62.5mW;最大工作电压:50V;温度系数:±100ppm/℃;; Manufacturer: YAGEO(国巨); Symbol: WR06X2212FTL; AddInBom: yes; ModelId: 671aefced39d4c318694bba8bd8efd39; ModelName: R0402_L1.0-W0.5-H0.5; ModelTransform: 39.37,19.685,0,0,0,0,0,0.0005,0; Tolerance: ±1%; Power(Watts): 62.5mW; Overload Voltage (Max): 50V; Device: RC0402FR-0722K1L; LCSC Part Name: 厚膜电阻 22.1kΩ ±1% 62.5mW; SupplierPart: C163478; ManufacturerPart: RC0402FR-0722K1L; Supplier Footprint: 0402; JLCPCB Part Class: Extended Part; Datasheet: https://atta.szlcsc.com/upload/public/pdf/source/20181009/C309620_DA5935B6E1D48212CB7A533FE518B3C2.pdf; Supplier: LCSC; ConvertToPcb: yes; FootprintName: R0402; Type: 厚膜电阻; Value: 22.1kΩ; Temperature Coefficient: ±100ppm/℃; Operating Temperature Range: -55℃~+155℃
R158 = AF0402FR-0747K5L: 电阻类型:厚膜电阻;阻值:47.5kΩ;精度:±1%;功率:62.5mW;最大工作电压:50V;温度系数:±100ppm/℃;; Manufacturer: YAGEO(国巨); Symbol: RCT0347K5FLF; AddInBom: yes; ModelId: 671aefced39d4c318694bba8bd8efd39; ModelName: R0402_L1.0-W0.5-H0.5; ModelTransform: 39.37,19.685,0,0,0,0,0,0.0005,0; Tolerance: ±1%; Power(Watts): 62.5mW; Overload Voltage (Max): 50V; Device: AF0402FR-0747K5L; LCSC Part Name: 厚膜电阻 47.5kΩ ±1% 62.5mW; SupplierPart: C723521; ManufacturerPart: AF0402FR-0747K5L; Supplier Footprint: 0402; JLCPCB Part Class: Extended Part; Datasheet: https://atta.szlcsc.com/upload/public/pdf/source/20200817/C723521_0B6B34734763438B18F9097B51841720.pdf; Supplier: LCSC; ConvertToPcb: yes; FootprintName: R0402; Type: 厚膜电阻; Value: 47.5kΩ; Temperature Coefficient: ±100ppm/℃; Operating Temperature Range: -55℃~+155℃
R164 R165 = RC0805FR-073K3L: 电阻类型:厚膜电阻;阻值:3.3kΩ;精度:±1%;功率:125mW;最大工作电压:150V;温度系数:±100ppm/℃;; Manufacturer: YAGEO(国巨); Symbol: RC0402FR-074K7L; AddInBom: yes; ModelId: 37a81e68749a4138bd2dfa6897b24b85; ModelName: R0805_L2.0-W1.3-H0.6; ModelTransform: 78.74,51.181,0,0,0,0,0,-0.0005,0; Tolerance: ±1%; Power(Watts): 125mW; Overload Voltage (Max): 150V; Device: RC0805FR-073K3L; LCSC Part Name: 厚膜电阻 3.3kΩ ±1% 125mW; SupplierPart: C114531; ManufacturerPart: RC0805FR-073K3L; Supplier Footprint: 0805; JLCPCB Part Class: Extended Part; Datasheet: https://atta.szlcsc.com/upload/public/pdf/source/20180821/C275644_0D56F95EFF785E7D9A1FEF436B37DA78.pdf; Supplier: LCSC; ConvertToPcb: yes; FootprintName: R0805; Type: 厚膜电阻; Value: 3.3kΩ; Temperature Coefficient: ±100ppm/℃; Operating Temperature Range: -55℃~+155℃
R170 = RC0402FR-07510RL: 电阻类型:厚膜电阻;阻值:510Ω;精度:±1%;功率:62.5mW;最大工作电压:50V;温度系数:±100ppm/℃;; Manufacturer: YAGEO(国巨); AddInBom: yes; ModelId: 671aefced39d4c318694bba8bd8efd39; ModelName: R0402_L1.0-W0.5-H0.5; ModelTransform: 39.37,19.685,0,0,0,0,0,0.0005,0; Tolerance: ±1%; Power(Watts): 62.5mW; Overload Voltage (Max): 50V; Symbol: RC0402FR-07510RL; Device: RC0402FR-07510RL; LCSC Part Name: 厚膜电阻 510Ω ±1% 62.5mW; SupplierPart: C276273; ManufacturerPart: RC0402FR-07510RL; Supplier Footprint: 0402; JLCPCB Part Class: 扩展库; Datasheet: https://atta.szlcsc.com/upload/public/pdf/source/20180904/C276339_014E484F1DBA106FB92D45EABD5A1AC1.pdf; Supplier: LCSC; ConvertToPcb: yes; FootprintName: R0402; Type: 厚膜电阻; Value: 510Ω; Temperature Coefficient: ±100ppm/℃; Operating Temperature Range: -55℃~+155℃
R171 R172 R180-R183 = RC0402FR-072K7L: 电阻类型:厚膜电阻;阻值:2.7kΩ;精度:±1%;功率:62.5mW;最大工作电压:50V;温度系数:±100ppm/℃;; Manufacturer: YAGEO(国巨); AddInBom: yes; ModelId: 671aefced39d4c318694bba8bd8efd39; ModelName: R0402_L1.0-W0.5-H0.5; ModelTransform: 39.37,19.685,0,0,0,0,0,0.0005,0; Tolerance: ±1%; Power(Watts): 62.5mW; Overload Voltage (Max): 50V; Symbol: RC0402FR-072K7L; Device: RC0402FR-072K7L; LCSC Part Name: 厚膜电阻 2.7kΩ ±1% 62.5mW; SupplierPart: C138017; ManufacturerPart: RC0402FR-072K7L; Supplier Footprint: 0402; JLCPCB Part Class: 扩展库; Datasheet: https://atta.szlcsc.com/upload/public/pdf/source/20181009/C309620_DA5935B6E1D48212CB7A533FE518B3C2.pdf; Supplier: LCSC; ConvertToPcb: yes; FootprintName: R0402; Type: 厚膜电阻; Value: 2.7kΩ; Temperature Coefficient: ±100ppm/℃; Operating Temperature Range: -55℃~+155℃
R173 = RC0402FR-07169RL: 电阻类型:厚膜电阻;阻值:169Ω;精度:±1%;功率:62.5mW;最大工作电压:50V;温度系数:±100ppm/℃;; Manufacturer: YAGEO(国巨); AddInBom: yes; ModelId: 671aefced39d4c318694bba8bd8efd39; ModelName: R0402_L1.0-W0.5-H0.5; ModelTransform: 39.37,19.685,0,0,0,0,0,0.0005,0; Tolerance: ±1%; Power(Watts): 62.5mW; Overload Voltage (Max): 50V; Symbol: RC0402FR-07169RL; Device: RC0402FR-07169RL; LCSC Part Name: 厚膜电阻 169Ω ±1% 62.5mW; SupplierPart: C138051; ManufacturerPart: RC0402FR-07169RL; Supplier Footprint: 0402; JLCPCB Part Class: 扩展库; Datasheet: https://atta.szlcsc.com/upload/public/pdf/source/20181009/C309620_DA5935B6E1D48212CB7A533FE518B3C2.pdf; Supplier: LCSC; ConvertToPcb: yes; FootprintName: R0402; Type: 厚膜电阻; Value: 169Ω; Temperature Coefficient: ±100ppm/℃; Operating Temperature Range: -55℃~+155℃
R174-R176 = RC0805FR-0775RL: 电阻类型:厚膜电阻;阻值:75Ω;精度:±1%;功率:125mW;最大工作电压:150V;温度系数:±100ppm/℃;; Manufacturer: YAGEO(国巨); AddInBom: yes; ModelId: 37a81e68749a4138bd2dfa6897b24b85; ModelName: R0805_L2.0-W1.3-H0.6; ModelTransform: 78.74,51.181,0,0,0,0,0,-0.0005,0; Tolerance: ±1%; Power(Watts): 125mW; Overload Voltage (Max): 150V; Symbol: RC0805FR-0775RL; Device: RC0805FR-0775RL; LCSC Part Name: 厚膜电阻 75Ω ±1% 125mW; SupplierPart: C141697; ManufacturerPart: RC0805FR-0775RL; Supplier Footprint: 0805; JLCPCB Part Class: 扩展库; Datasheet: https://atta.szlcsc.com/upload/public/pdf/source/20180821/C275644_0D56F95EFF785E7D9A1FEF436B37DA78.pdf; Supplier: LCSC; ConvertToPcb: yes; FootprintName: R0805; Type: 厚膜电阻; Value: 75Ω; Temperature Coefficient: ±100ppm/℃; Operating Temperature Range: -55℃~+155℃
R177 = RC0402FR-0733RL: 电阻类型:厚膜电阻;阻值:33Ω;精度:±1%;功率:62.5mW;最大工作电压:50V;温度系数:±100ppm/℃;; Manufacturer: YAGEO(国巨); AddInBom: yes; ModelId: 671aefced39d4c318694bba8bd8efd39; ModelName: R0402_L1.0-W0.5-H0.5; ModelTransform: 39.37,19.685,0,0,0,0,0,0.0005,0; Tolerance: ±1%; Power(Watts): 62.5mW; Overload Voltage (Max): 50V; Symbol: RC0402FR-0733RL; Device: RC0402FR-0733RL; LCSC Part Name: 厚膜电阻 33Ω ±1% 62.5mW; SupplierPart: C138002; ManufacturerPart: RC0402FR-0733RL; Supplier Footprint: 0402; JLCPCB Part Class: 扩展库; Datasheet: https://atta.szlcsc.com/upload/public/pdf/source/20181009/C309620_DA5935B6E1D48212CB7A533FE518B3C2.pdf; Supplier: LCSC; ConvertToPcb: yes; FootprintName: R0402; Type: 厚膜电阻; Value: 33Ω; Temperature Coefficient: ±100ppm/℃; Operating Temperature Range: -55℃~+155℃
TP19 TP20 = Test-Point: Test Point 测试点; AddInBom: yes; Device: Test-Point; ConvertToPcb: yes; SymbolName: Test-Point; FootprintName: Test-Point-0.5mm
U104 = CP2102N-A02-GQFN28R: 应用功能:USB转UART;接口协议:UART;; Manufacturer: SKYWORKS/SILICON LABS(芯科); Protocol: UART; Supply Voltage: 3V~3.6V; AddInBom: yes; ModelId: 1010cdab9a9c4ce79fb2e6cc0ab36b8d; ModelName: QFN-28_L5.0-W5.0-H0.9-P0.50; ModelTransform: 196.85,196.85,0,0,0,0,0,0,0; LCSC Part Name: USB 2.0全速功能控制器，USB收发器，振荡器和通用异步接收机/发射机(UART); Supplier Footprint: QFN-28-EP(5x5); Symbol: CP2102N-A02-GQFN28R; Device: CP2102N-A02-GQFN28R; Applications Function: USB转UART; Operating Temperature: -40℃~+85℃@(Ta); SupplierPart: C964632; ManufacturerPart: CP2102N-A02-GQFN28R; JLCPCB Part Class: Extended Part; Datasheet: https://atta.szlcsc.com/upload/public/pdf/source/20201204/C964632_F2B790CC23A72455AEF523510305B30A.pdf; Supplier: LCSC; ConvertToPcb: yes; FootprintName: QFN-28_L5.0-W5.0-P0.50-TL-EP3.3; Type: -; Number of Drivers/Receivers: -; Data Rate: -
U105 = RC0402FR-0710KL: 电阻类型:厚膜电阻;阻值:10kΩ;精度:±1%;功率:62.5mW;最大工作电压:50V;温度系数:±100ppm/℃;; Manufacturer: YAGEO(国巨); Convert to PCB: yes; ModelId: 671aefced39d4c318694bba8bd8efd39; ModelName: R0402_L1.0-W0.5-H0.5; ModelTransform: 39.37,19.685,0,0,0,0,0,0.0005,0; Tolerance: ±1%; Power(Watts): 62.5mW; Overload Voltage (Max): 50V; Device: RC0402FR-0710KL; Symbol: 10kΩ; Supplier: LCSC; Supplier Part: C60490; Manufacturer Part: RC0402FR-0710KL; JLCPCB Part Class: Extended Part; link: https://so.szlcsc.com/global.html?k=C5139509&amp;ref=editor; Add into BOM: yes; LCSC Part Name: 厚膜电阻 10kΩ ±1% 62.5mW; Supplier Footprint: 0402; Datasheet: https://atta.szlcsc.com/upload/public/pdf/source/20170925/C131467_1506321478108990263.pdf; FootprintName: R0402; Type: 厚膜电阻; Value: 10kΩ; Temperature Coefficient: ±100ppm/℃; Operating Temperature Range: -55℃~+155℃
U108 U109 = APT3216SGC: 发光颜色:翠绿色;正向电压(VF):2.2V;正向电流:20mA;主波长:568nm;透镜颜色:无色透明透镜;发光强度:12mcd;发光角度:120°;; Manufacturer: Kingbright; AddInBom: yes; ModelId: 25c52fe4797543dba3be0628b2a2389b; ModelTransform: 118.18874,59.4487,0,0,0,0,0,0,0; Emitted Color: 翠绿色; Forward Voltage (VF): 2.2V; Forward Current: 20mA; Dominant Wavelength: 568nm; Peak Wavelength: 565nm; Lens Color: 无色透明透镜; Luminous Intensity: 12mcd; Viewing Angle: 120°; Symbol: APT3216SGC; Device: APT3216SGC; LCSC Part Name: APT3216SGC; SupplierPart: C5875760; ManufacturerPart: APT3216SGC; Supplier Footprint: 1206; JLCPCB Part Class: 扩展库; Datasheet: https://atta.szlcsc.com/upload/public/pdf/source/20240417/40CF3267DD1033400CB26B372702289F.pdf; Supplier: LCSC; ConvertToPcb: yes; FootprintName: LED1206-RD; ModelName: LED1206-RD
U111 = ADV7393BCPZ-REEL: 类型:视频编码器;; Manufacturer: ADI(亚德诺); AddInBom: yes; ModelId: c51b269f99a14e5593761ba22a15bc72; ModelTransform: 237.007,237.007,0,0,0,0,0,0,0; Symbol: ADV7393BCPZ-REEL; Device: ADV7393BCPZ-REEL; Supplier: LCSC; SupplierPart: C662241; ManufacturerPart: ADV7393BCPZ-REEL; JLCPCB Part Class: 扩展库; LCSC Part Name: 低功耗 芯片规模 10位SD/HD视频编码器; Supplier Footprint: LFCSP-40(6x6); Datasheet: https://atta.szlcsc.com/upload/public/pdf/source/20200623/C662241_F7DA494034A969D691B154DBAB3917CE.pdf; ConvertToPcb: yes; Type: 视频编码器; FootprintName: LFCSP-40_L6.0-W6.0-P0.50-BL-EP4.1; ModelName: LFCSP-40_L6.0-W6.0-P0.50-BL-EP4.1
U112 = GRM1555C1H222GA01D: 容值:2.2nF;精度:±2%;额定电压:50V;材质(温度系数):C0G;; Manufacturer: muRata(村田); AddInBom: yes; ModelId: 36a51122f27c49738f86b3bfa98863e0; ModelName: C0402_L1.0-W0.5-H0.5; ModelTransform: 39.37,19.685,0,0,0,0,0,0,0; Tolerance: ±2%; Voltage Rated: 50V; Temperature Coefficient: C0G; Symbol: GRM1555C1H222GA01D; Device: GRM1555C1H222GA01D; LCSC Part Name: 2.2nF ±2% 50V; SupplierPart: C2987940; ManufacturerPart: GRM1555C1H222GA01D; Supplier Footprint: 0402; JLCPCB Part Class: 扩展库; Datasheet: https://atta.szlcsc.com/upload/public/pdf/source/20220621/5EF4CCD082DE813B006385516F1D1A09.pdf; Supplier: LCSC; ConvertToPcb: yes; FootprintName: C0402; Value: 2.2nF
U114 = TPS7A2018PDBVR: 输出类型:固定;最大输入电压:6V;输出电压:1.8V;最大输出电流:300mA;输出极性:正极;; Manufacturer: TI(德州仪器); AddInBom: yes; ModelId: 7ba65df16e7b4570af156e925f9c37fe; ModelTransform: 114.173,114.173,0,90,0,0,0,0,0; Output Type: 固定; Maximum Input Voltage: 6V; Output Voltage: 1.8V; MAX Output Current: 300mA; Dropout Voltage: 200mV@(300mA); standby current: 15uA; Output Polarity: 正极; Number of Outputs: 1; Symbol: TPS7A2018PDBVR; Device: TPS7A2018PDBVR; LCSC Part Name: TPS7A2018PDBVR; SupplierPart: C963430; ManufacturerPart: TPS7A2018PDBVR; Supplier Footprint: SOT-23-5L; JLCPCB Part Class: 扩展库; Datasheet: https://www.ti.com/cn/lit/gpn/tps7a20; Supplier: LCSC; ConvertToPcb: yes; FootprintName: SOT-23-5_L2.9-W1.6-P0.95-LS2.8-BR; ModelName: SOT-23-5_L2.9-W1.6-P0.95-LS2.8-BR; Operating Temperature: -40℃~+125℃@(Tj)
U115-U117 = SN74AVC8T245PWR: 电路数:1;每个电路通道数:8;; Manufacturer: TI(德州仪器); AddInBom: yes; ModelId: 57e278220af748a2882c4abba4094eb9; ModelName: TSSOP-24_L7.8-W4.4-H1.0-LS6.4-P0.65; ModelTransform: 252.188,307.086,0,90,0,0,0,0,0; Number of Circuits: 1; Channels per Circuit: 8; Output Type: 三态; Symbol: SN74AVC8T245PWR; Device: SN74AVC8T245PWR; LCSC Part Name: SN74AVC8T245PWR; SupplierPart: C465742; ManufacturerPart: SN74AVC8T245PWR; Supplier Footprint: TSSOP-24; JLCPCB Part Class: 扩展库; Datasheet: https://www.ti.com/cn/lit/gpn/sn74avc8t245; Supplier: LCSC; ConvertToPcb: yes; FootprintName: TSSOP-24_L7.8-W4.4-P0.65-LS6.4-BL; Operating Temperature: -40℃~+85℃
U118 = RCA-Y: 黄色RCA端子; AddInBom: yes; ModelId: fdc09737ada6459791dfeb36dbb993bd; ModelName: CONN-TH_RCA_JACK_C9900006878; ModelTransform: 453.15000000000003,580.71,669.29,180,0,0,0,-78.74,-157.48; Device: RCA-Y; ConvertToPcb: yes; SymbolName: RCA-Y; FootprintName: RCA-Y
U120 = MINI_DIN_4: MINI_DIN_4PIN，S-VIDEO用; AddInBom: yes; ModelId: 92cc0482c9554c8b985b0993391355350819f05c4eef4c71ace90d822a990e87; ModelName: AUDIO-TH_MINI-DIN4; ModelTransform: 562.2,529.13,708.66,180,0,0,0,-78.74,-196.85; Device: MINI_DIN_4; ConvertToPcb: yes; SymbolName: MINI_DIN_4; FootprintName: MINI_DIN_4
USB4 = TYPE-C 16PIN 2MD(073): 连接器类型:Type-C;标准:-;公母:母;触点数量:16P;端口数量:1;安装方式:卧贴;额定电流 - 电源:5A;工作温度范围:-25℃~+85℃;; Manufacturer: SHOU HAN(首韩); AddInBom: yes; ModelId: 3a41b9ec9b654a0fad4d118405ec6290; ModelTransform: 351.9678,298.4246,0,0,0,0,0,-47.244,-35.433; Gender: 母; Number of Contacts: 16P; Number of Ports: 1; Current Rating - Power (Max): 5A; Symbol: TYPE-C 16PIN 2MD(073); Device: TYPE-C 16PIN 2MD(073); Supplier: LCSC; Supplier Part: C2765186; Manufacturer Part: TYPE-C 16PIN 2MD(073); JLCPCB Part Class: 扩展库; LCSC Part Name: Type-C 母 卧贴 带定位柱 不锈钢外壳 2次模顶; Supplier Footprint: SMD; Datasheet: https://atta.szlcsc.com/upload/public/pdf/source/20211123/39B17C16241EAC15C5E277BDA434118E.pdf; ConvertToPcb: yes; FootprintName: USB-C-SMD_TYPE-C-6PIN-2MD-073; ModelName: USB-C-SMD_TYPE-C-6PIN-2MD-073; Connector Type: Type-C; Standard: -; Mounting Style: 卧贴; Operating Temperature Range: -25℃~+85℃